# EAGLE design big-module-test1 (EAGLE 6.5.0)
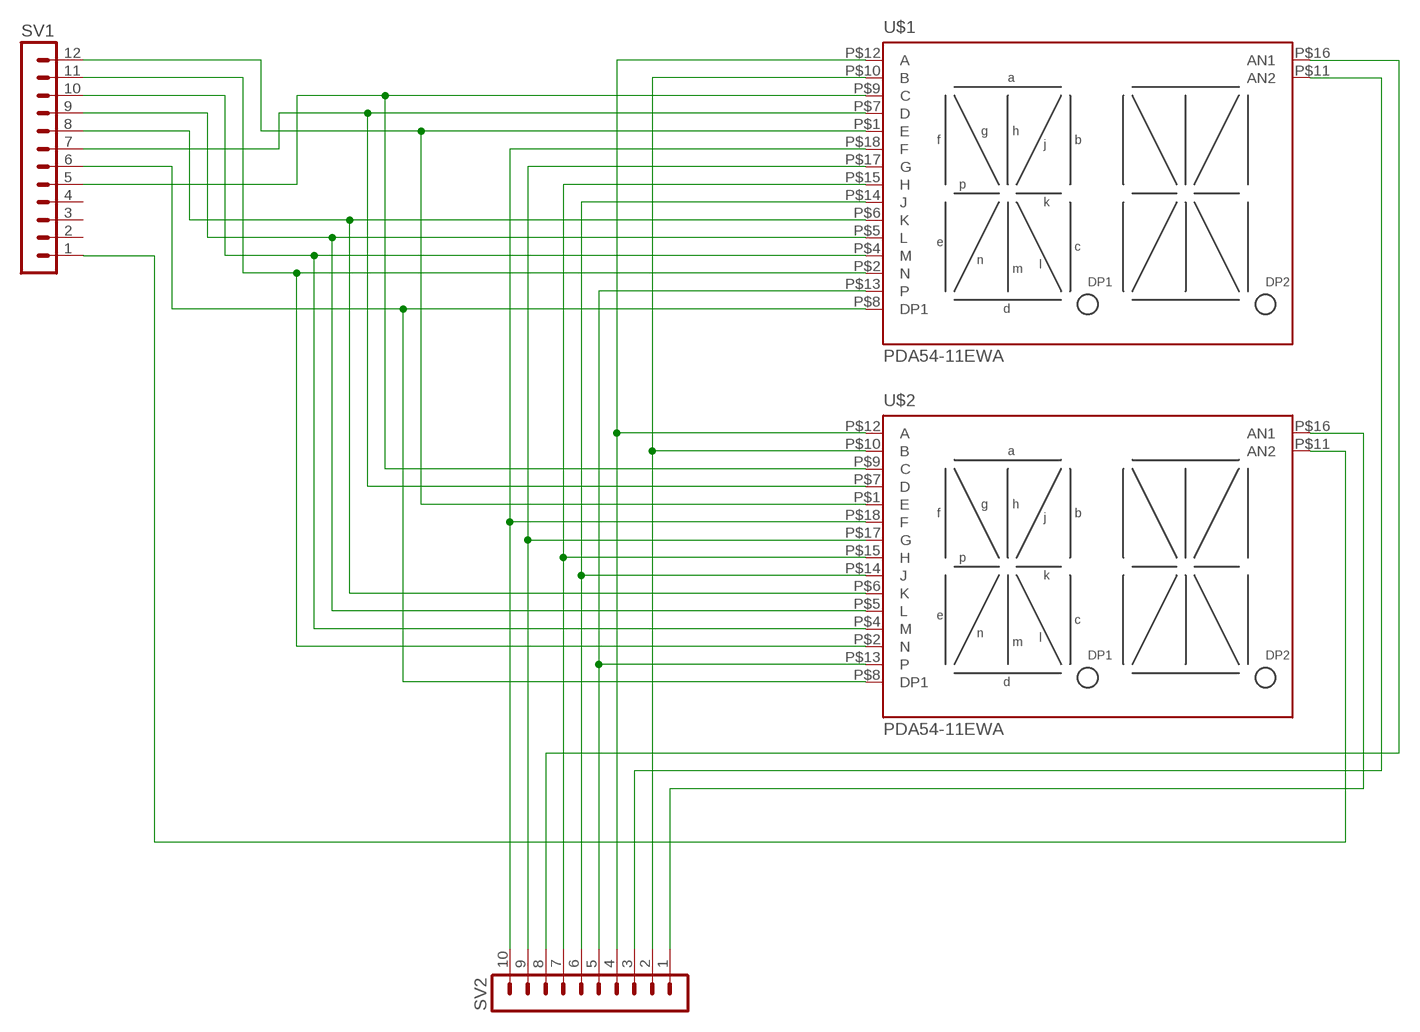
[diagram p0: schematic, sheet 1]

## Parts
SV1  MA12-1W  [MA12-1W]
SV2  MA10-1  [MA10-1]
U$1  PDA54-11EWA  [PDA54-11XX]
U$2  PDA54-11EWA  [PDA54-11XX]

## Nets
N$1: SV1.12 U$1.P$1(E) U$2.P$1(E)
N$2: SV1.11 U$1.P$2(N) U$2.P$2(N)
N$3: SV1.10 U$1.P$4(M) U$2.P$4(M)
N$4: SV1.9 U$1.P$5(L) U$2.P$5(L)
N$5: SV1.8 U$1.P$6(K) U$2.P$6(K)
N$6: SV1.7 U$1.P$7(D) U$2.P$7(D)
N$7: SV1.6 U$1.P$8(DP1) U$2.P$8(DP1)
N$8: SV1.5 U$1.P$9(C) U$2.P$9(C)
N$9: SV2.10 U$1.P$18(F) U$2.P$18(F)
N$10: SV2.9 U$1.P$17(G) U$2.P$17(G)
N$11: SV2.8 U$1.P$16(AN1)
N$12: SV2.7 U$1.P$15(H) U$2.P$15(H)
N$13: SV2.6 U$1.P$14(J) U$2.P$14(J)
N$14: SV2.5 U$1.P$13(P) U$2.P$13(P)
N$15: SV2.4 U$1.P$12(A) U$2.P$12(A)
N$16: SV2.3 U$1.P$11(AN2)
N$17: SV2.2 U$1.P$10(B) U$2.P$10(B)
N$18: SV2.1 U$2.P$16(AN1)
N$20: SV1.1 U$2.P$11(AN2)
Unconnected: SV1.2 SV1.3 SV1.4

## Library data of the parts
SV1 = con-lstb:MA12-1W: PIN HEADER; OC_FARNELL: unknown; OC_NEWARK: unknown
SV2 = con-lstb:MA10-1: PIN HEADER; OC_FARNELL: unknown; OC_NEWARK: unknown
U$1 U$2 = eagle-library-edeca.net-v5-mix:PDA54-11EWA: Kingbright PDA54-11EWA 14 segment common anode LED display

## Board
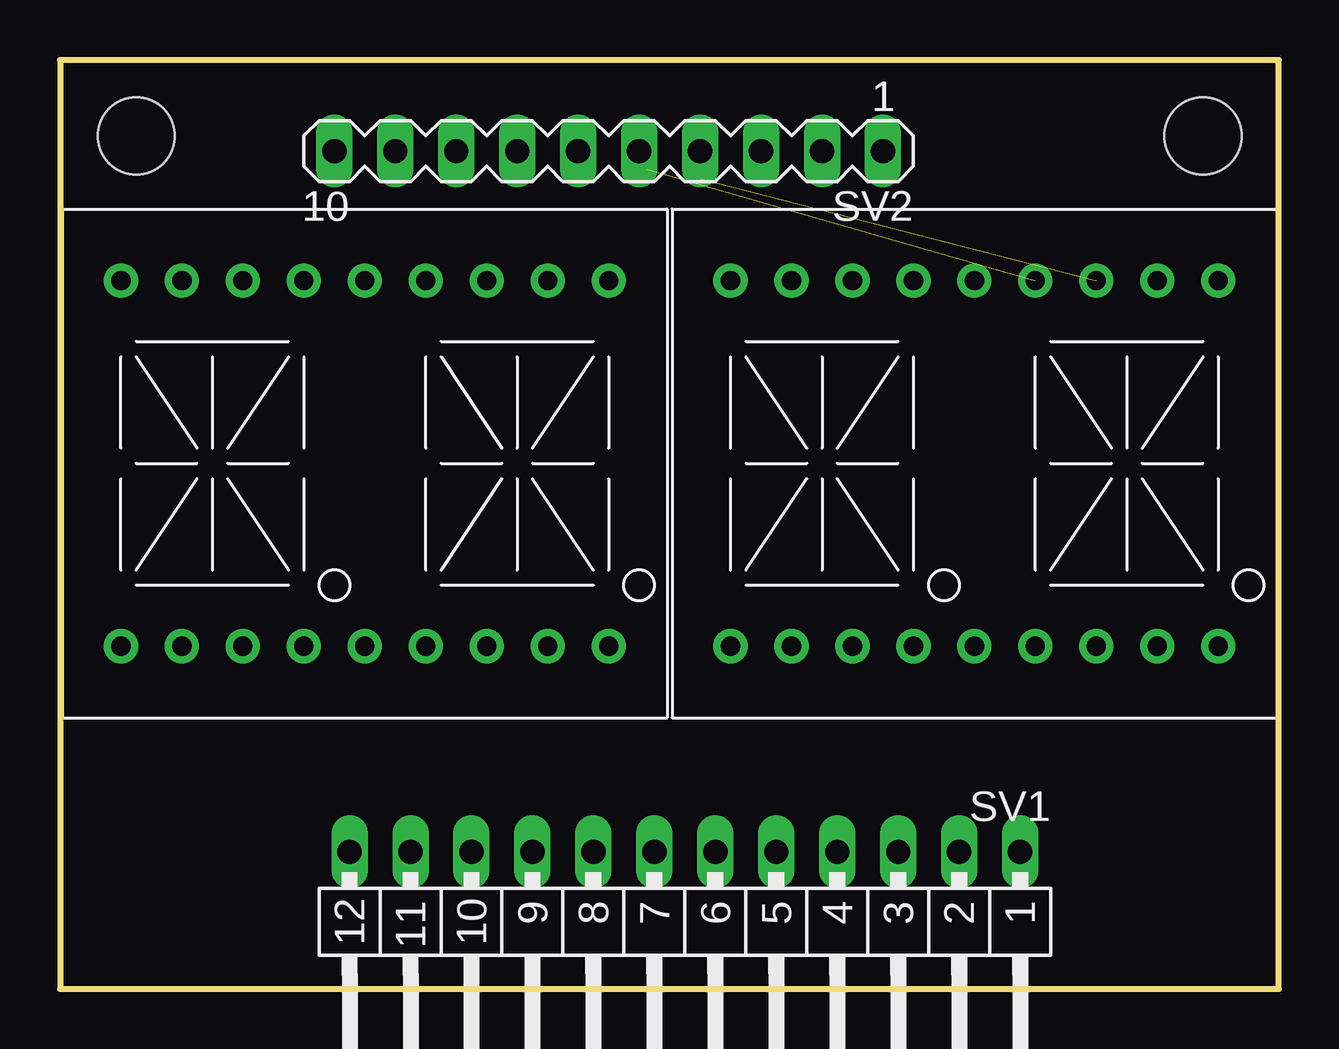
[diagram p1: board, top side]
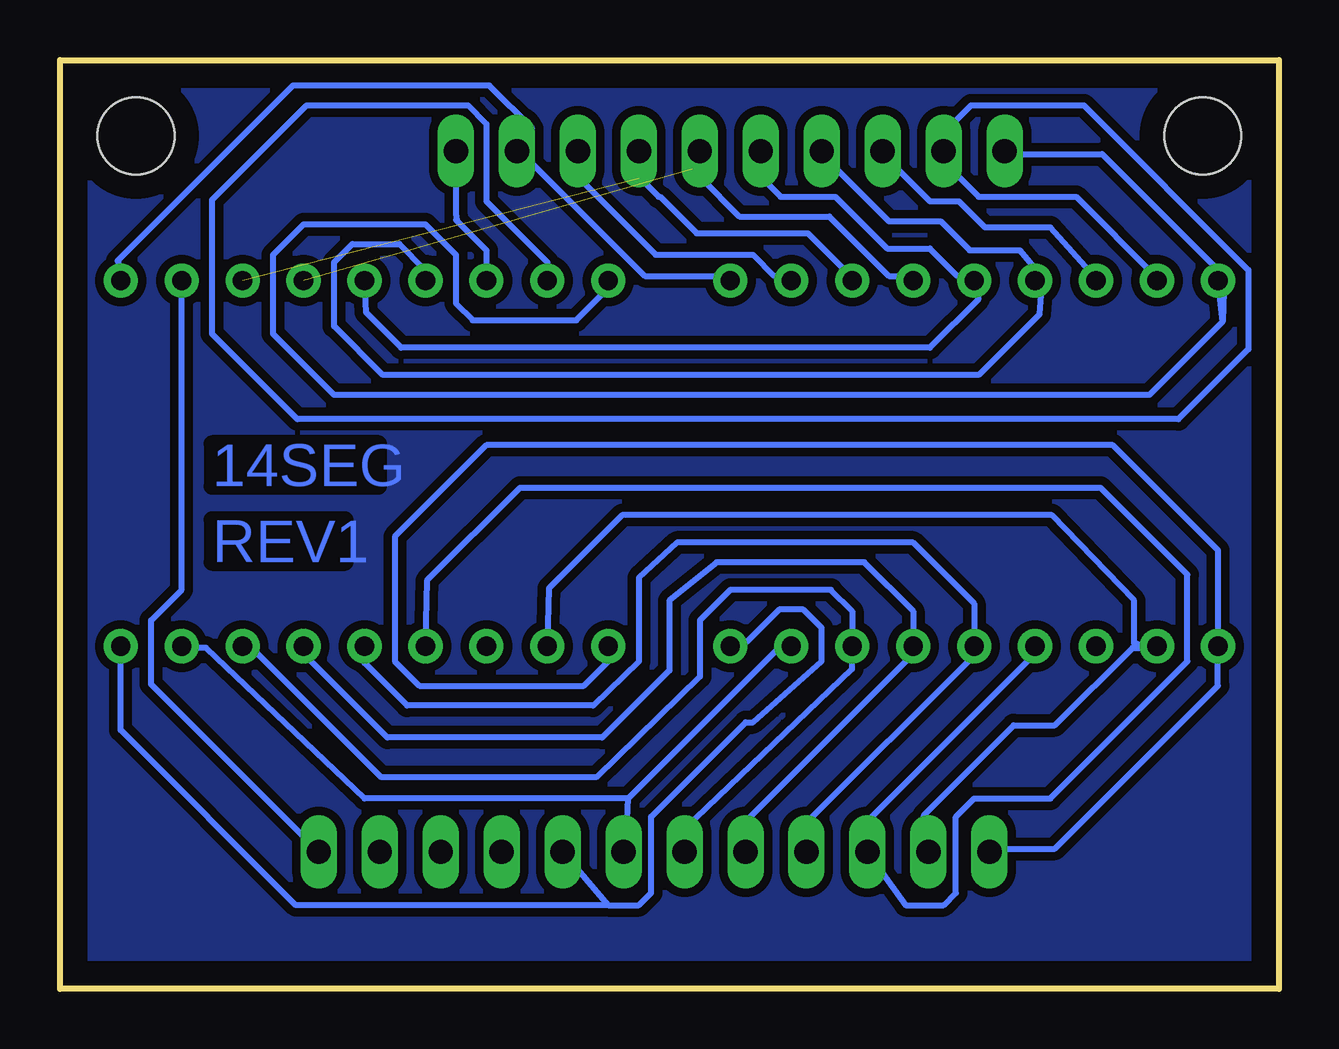
[diagram p2: board, bottom side, seen from below]

Size 50.79 x 38.73 mm. Coordinates in mm from the lower left corner, seen from the top.
Outline: 0,0 50.79,0 50.79,38.73 0,38.73 0,0
Copper layers (1*16): Top 0.035mm / dielectric 1.5mm / Bottom 0.035mm
Design rules "default *": minimum track width 10mil, minimum drill 24mil, track to track 14mil, track to pad 14mil, pad to pad 14mil, via to via 14mil, smd to smd 8mil, copper to edge 40mil, drill to drill 8mil, minimum pad ring 10mil, minimum via ring 8mil, stop-mask expansion 4mil, vias tented up to drill 0mil, thermal gap 10mil
Holes 3.2 mm at 47.62,35.56 3.17,35.56
tRestrict: area 1.3,0 to 49.5,7.6; area 1.9,13.7 to 3.2,14.9; area 4.4,13.7 to 5.7,14.9; area 7,13.7 to 8.3,14.9; area 9.5,13.7 to 10.8,14.9; area 12.1,13.7 to 13.3,14.9; area 14.6,13.7 to 15.9,14.9; area 17.1,13.7 to 18.4,14.9; area 19.7,13.7 to 21,14.9; area 22.2,13.7 to 23.5,14.9; area 27.3,13.7 to 28.6,14.9; area 29.8,13.7 to 31.1,14.9; 25 more areas
vRestrict: area 0.6,27.9 to 50.8,32.4; area 0,11.4 to 50.2,15.9

### Footprints (pad centres in the part's own frame; a part is rotated, then mirrored left to right if it is on the bottom)
MA12-1W = drill 1.016 long: 1 -13.97,0; 2 -11.43,0; 3 -8.89,0; 4 -6.35,0; 5 -3.81,0; 6 -1.27,0; 7 1.27,0; 8 3.81,0; 9 6.35,0; 10 8.89,0; 11 11.43,0; 12 13.97,0
MA10-1 = drill 1.016 long: 1 -11.43,0; 2 -8.89,0; 3 -6.35,0; 4 -3.81,0; 5 -1.27,0; 6 1.27,0; 7 3.81,0; 8 6.35,0; 9 8.89,0; 10 11.43,0
PDA54-11XX = drill 0.8 pad 1.422: P$1 -10.16,-7.62; P$2 -7.62,-7.62; P$3 -5.08,-7.62; P$4 -2.54,-7.62; P$5 0,-7.62; P$6 2.54,-7.62; P$7 5.08,-7.62; P$8 7.62,-7.62; P$9 10.16,-7.62; P$10 10.16,7.62; P$11 7.62,7.62; P$12 5.08,7.62; P$13 2.54,7.62; P$14 0,7.62; P$15 -2.54,7.62; P$16 -5.08,7.62; P$17 -7.62,7.62; P$18 -10.16,7.62

### Placement (x,y rotation side)
SV1  26.04,5.71 180 top
SV2  22.86,34.92 180 top
U$1  12.7,21.91 0 top
U$2  38.1,21.91 0 top

### Tracks (layer width: path | path; a pad name or v marks a point on that pad's centre or on a via)
N$1
  Bottom 0.254: SV1.12 11.94,5.84 9.34,5.84 2.54,12.64 U$1.P$1 2.54,18.29 6.92,22.67 33.02,22.67 36.83,18.86 36.83,13.65 35.81,12.64 28.96,12.64 27.69,13.91 27.94,14.22 U$2.P$1
N$2
  Bottom 0.254: 5.52,14.22 6.1,14.22 9.34,10.99 11.05,10.99 14.8,7.24 14.48,5.84 SV1.11 | 5.52,14.22 5.08,14.22 U$1.P$2 | 5.52,14.22 6.03,14.41 6.03,16.19 9.46,19.75 27.37,19.75 30.42,16.7 30.48,14.48 U$2.P$2
N$3
  Bottom 0.254: U$1.P$4 10.48,13.65 17.14,6.99 SV1.10 15.56,3.49 13.97,3.49 13.46,4 13.46,7.18 12.7,7.94 9.53,7.94 3.81,13.65 3.81,17.27 7.43,20.89 31.62,20.89 35.5,17.02 35.56,14.48 U$2.P$4
N$4
  Bottom 0.254: SV1.9 19.81,6.79 12.7,13.91 U$1.P$5 12.7,16.07 15.24,18.61 25.08,18.61 26.67,17.14 26.67,13.65 28.57,11.81 36.32,11.81 38.1,13.59 U$2.P$5
N$5
  Bottom 0.254: SV1.8 22.23,6.99 15.24,13.97 U$1.P$6 15.24,15.75 17.27,17.78 23.43,17.78 25.4,16.19 25.4,13.27 28.19,10.48 37.15,10.48 40.58,13.91 40.64,14.22 U$2.P$6
N$6
  Bottom 0.254: SV1.7 24.77,6.67 17.78,13.34 U$1.P$7 17.78,15.75 18.67,16.64 22.86,16.64 24.13,15.37 24.13,13.02 28.45,8.83 37.4,8.83 42.8,14.22 43.18,14.22 U$2.P$7
N$7
  Bottom 0.254: U$1.P$8 20.95,14.1 27.11,7.94 | 27.11,7.94 27.18,6.6 27.18,5.84 SV1.6 | 27.11,7.94 38.1,7.94 44.7,14.22 45.72,14.22 U$2.P$8
N$8
  Bottom 0.254: 27.94,3.49 26.67,3.49 26.16,4 26.16,7.18 22.23,11.11 21.91,11.11 19.05,13.65 19.05,15.05 19.81,15.81 20.83,15.81 22.16,14.48 22.86,14.48 U$1.P$9 | SV1.5 27.94,3.49 | U$2.P$9 48.26,10.79 40.96,3.49 27.94,3.49
N$9
  Bottom 0.254: 2.35,27.81 2.29,29.72 7.37,34.8 11.43,34.8 SV2.10 | 2.35,27.81 2.54,29.72 U$1.P$18 | 2.35,27.81 5.4,24.77 39.37,24.77 41.91,27.3 41.91,30.61 40.64,31.88 35.56,31.88 34.29,30.61 34.29,28.57 33.59,27.88 29.27,27.88 28,29.15 27.94,29.46 U$2.P$18
N$10
  Bottom 0.254: 13.65,34.16 13.49,34 | 13.49,34 12.51,33.02 8.45,33.02 5.14,29.72 5.08,29.72 U$1.P$17 | U$2.P$17 30.48,30.29 33.02,32.83 33.02,36.07 33.78,36.83 40.51,36.83 44.45,32.89 44.45,27.3 40.89,23.75 4.19,23.75 1.27,26.67 1.27,29.97 8.13,36.83 12.83,36.83 14.32,35.34 | 14.29,35.05 14.32,35.34 | 14.32,35.34 13.97,35.31 SV2.9 14.22,35.05 14.22,34.8 13.46,34.04 13.49,34
N$11
  Bottom 0.254: U$1.P$16 7.62,29.72 7.68,29.72 9.53,31.75 12.26,31.75 13.34,32.83 14.54,32.83 16.51,34.8 SV2.8
N$12
  Bottom 0.254: 9.84,29.72 9.97,28.13 12.51,25.59 37.34,25.59 39.37,27.62 39.37,30.29 38.61,31.05 36.64,31.05 35.62,30.04 35.56,29.72 U$2.P$15 | 9.84,29.72 9.91,29.72 10.79,30.8 12.89,30.8 14.1,32 16.26,32 19.05,34.8 SV2.7 | 9.84,29.72 U$1.P$15
N$13
  Bottom 0.254: 12.7,29.72 13.4,29.72 14.54,30.86 16.32,30.86 18.48,33.02 20.77,33.02 21.56,33.81 | 12.7,29.72 12.51,28.77 14.54,26.73 36.58,26.73 38.04,28.19 38.1,29.46 U$2.P$14 | 21.59,33.85 21.56,33.81 | 12.7,29.72 U$1.P$14 | SV2.6 21.59,33.78 21.56,33.81
N$14  (1 unrouted)
  Bottom 0.254: 24.45,34.16 24.1,33.81 | 24.1,33.81 22.48,32.19 18.73,32.19 16.26,29.72 15.24,29.72 U$1.P$13 | SV2.5 24.13,33.78 24.1,33.81
N$15  (1 unrouted)
  Bottom 0.254: 26.67,33.85 26.64,33.81 | 26.64,33.81 25.84,33.02 25.78,33.02 24.26,31.5 19.62,31.5 17.84,29.72 17.78,29.72 U$1.P$12 | SV2.4 26.67,33.78 26.64,33.81
N$16
  Bottom 0.254: 29.21,33.85 29.18,33.81 | 29.18,33.81 25.97,30.61 21.91,30.61 21.02,29.72 20.32,29.72 U$1.P$11 | SV2.3 29.21,33.78 29.18,33.81
N$17
  Bottom 0.254: 31.75,35.05 26.42,29.72 22.86,29.72 U$1.P$10 | 31.75,35.05 31.11,35.88 32.89,37.66 41.08,37.66 48.39,30.35 48.26,29.72 U$2.P$10 | 31.75,35.05 SV2.2
N$18
  Bottom 0.254: U$2.P$16 33.02,30.8 34.26,32.04 | 34.29,32.07 34.26,32.04 | SV2.1 34.29,32.32 34.26,32.04
N$19
  pour Bottom: -0.32,38.73 50.48,38.73 50.8,0 0,0
N$20
  Bottom 0.254: U$2.P$11 45.72,16.64 46.99,15.37 46.99,12.7 SV1.1

### Text on the board
Bottom: 14SEG | REV1